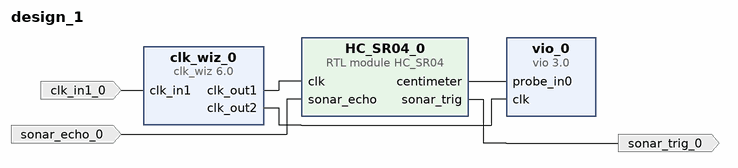
[diagram p0: block diagram of the top level]
# Vivado block design design_1, xc7z020clg400-1, Vivado 2023.2
create_bd_design design_1

create_bd_port -dir O sonar_trig_0
create_bd_port -dir I sonar_echo_0
create_bd_port -dir I -type clk clk_in1_0
set_property -dict {CONFIG.FREQ_HZ 125000000} [get_bd_ports clk_in1_0]

create_bd_cell -type ip -vlnv xilinx.com:ip:vio:3.0 vio_0
set_property -dict {CONFIG.C_NUM_PROBE_OUT 0} [get_bd_cells vio_0]
create_bd_cell -type ip -vlnv xilinx.com:ip:clk_wiz:6.0 clk_wiz_0
set_property -dict [list \
  CONFIG.CLKIN1_JITTER_PS 80.0 \
  CONFIG.CLKOUT1_JITTER 205.508 \
  CONFIG.CLKOUT1_PHASE_ERROR 233.292 \
  CONFIG.CLKOUT2_JITTER 184.005 \
  CONFIG.CLKOUT2_PHASE_ERROR 233.292 \
  CONFIG.CLKOUT2_REQUESTED_OUT_FREQ 210 \
  CONFIG.CLKOUT2_USED true \
  CONFIG.MMCM_CLKFBOUT_MULT_F 42.000 \
  CONFIG.MMCM_CLKIN1_PERIOD 8.000 \
  CONFIG.MMCM_CLKOUT0_DIVIDE_F 10.500 \
  CONFIG.MMCM_CLKOUT1_DIVIDE 5 \
  CONFIG.MMCM_DIVCLK_DIVIDE 5 \
  CONFIG.NUM_OUT_CLKS 2 \
  CONFIG.PRIM_IN_FREQ 125 \
  CONFIG.USE_LOCKED false \
  CONFIG.USE_RESET false \
] [get_bd_cells clk_wiz_0]
create_bd_cell -type module -reference HC_SR04 HC_SR04_0

# ---- connections ----

connect_bd_net [get_bd_pins HC_SR04_0/centimeter] [get_bd_pins vio_0/probe_in0]
connect_bd_net [get_bd_pins HC_SR04_0/sonar_trig] [get_bd_ports sonar_trig_0]
connect_bd_net -net clk_in1_0_1 [get_bd_ports clk_in1_0] [get_bd_pins clk_wiz_0/clk_in1]
connect_bd_net [get_bd_pins clk_wiz_0/clk_out1] [get_bd_pins HC_SR04_0/clk]
connect_bd_net [get_bd_pins clk_wiz_0/clk_out2] [get_bd_pins vio_0/clk]
connect_bd_net -net sonar_echo_0_1 [get_bd_ports sonar_echo_0] [get_bd_pins HC_SR04_0/sonar_echo]

validate_bd_design
save_bd_design
